# Altium schematic sheet AT89S52继电器工控板.SCHDOC
size A3
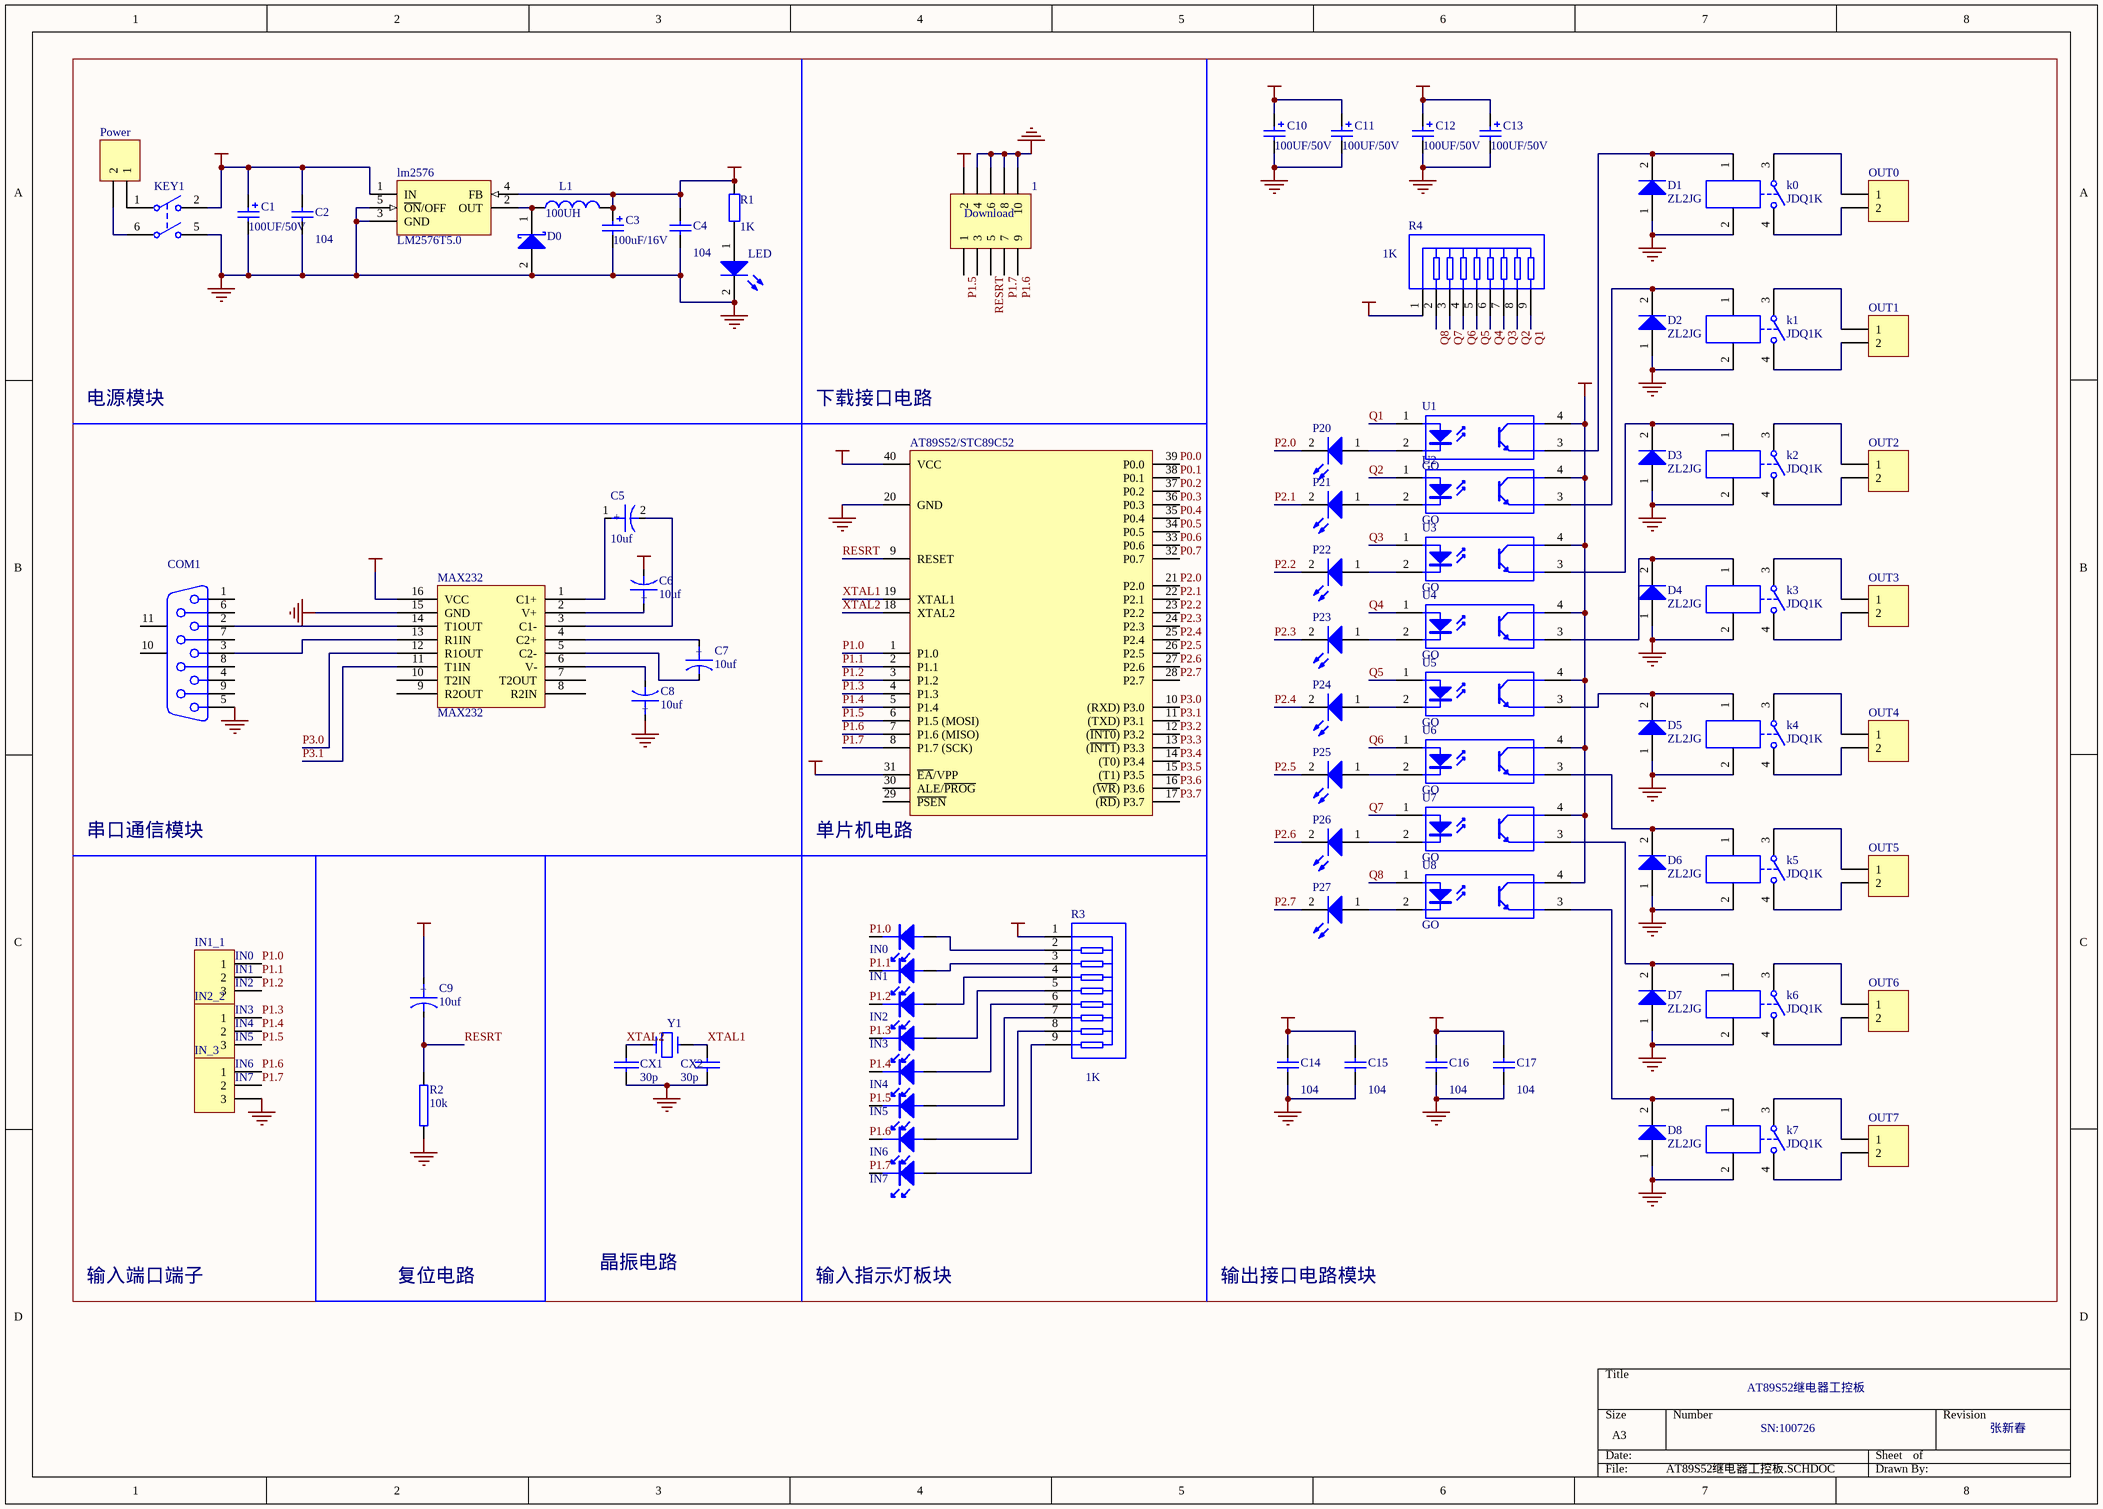
[diagram p0: AT89S52继电器工控板.SCHDOC]

## Parts
1  Download  [HDR-2x5]
AT89S52/STC89C52  (no value)  [DIP-40]
C1  value 100UF/50V  [C-DJ-6]  (hidden comment: DJDR)
C2  value 104  [CPDR]  (hidden comment: CPDR)
C3  value 100uF/16V  [C-DJ-6]  (hidden comment: DJDR)
C4  value 104  [CPDR]  (hidden comment: CPDR)
C5  10uf  [C-DJ-4]
C6  10uf  [C-DJ-4]
C7  10uf  [C-DJ-4]
C8  10uf  [C-DJ-4]
C9  10uf  [C-DJ-4]
C10  value 100UF/50V  [C-DJ-6]  (hidden comment: DJDR)
C11  value 100UF/50V  [C-DJ-6]  (hidden comment: DJDR)
C12  value 100UF/50V  [C-DJ-6]  (hidden comment: DJDR)
C13  value 100UF/50V  [C-DJ-6]  (hidden comment: DJDR)
C14  value 104  [CPDR]  (hidden comment: CPDR)
C15  value 104  [CPDR]  (hidden comment: CPDR)
C16  value 104  [CPDR]  (hidden comment: CPDR)
C17  value 104  [CPDR]  (hidden comment: CPDR)
COM1  D Connector 9  [DSUB1.385-2H9]  (value not drawn)
CX1  30p  [HDR1X2]
CX2  30p  [HDR1X2]
D0  WY2JG  [ZCDZL]  (value not drawn)
D1  ZL2JG  [D-ZL-10]
D2  ZL2JG  [D-ZL-10]
D3  ZL2JG  [D-ZL-10]
D4  ZL2JG  [D-ZL-10]
D5  ZL2JG  [D-ZL-10]
D6  ZL2JG  [D-ZL-10]
D7  ZL2JG  [D-ZL-10]
D8  ZL2JG  [D-ZL-10]
IN0  LED  [HDR1X2]  (value not drawn)
IN1  LED  [HDR1X2]  (value not drawn)
IN1_1  PZ_3  [JK128_3]  (value not drawn)
IN2  LED  [HDR1X2]  (value not drawn)
IN2_2  PZ_3  [JK128_3]
IN3  LED  [HDR1X2]  (value not drawn)
IN4  LED  [HDR1X2]  (value not drawn)
IN5  LED  [HDR1X2]  (value not drawn)
IN6  LED  [HDR1X2]  (value not drawn)
IN7  LED  [HDR1X2]  (value not drawn)
IN_3  (no value)  [JK128_3]
k0  JDQ1K  [JDQ1KI]
k1  JDQ1K  [JDQ1KI]
k2  JDQ1K  [JDQ1KI]
k3  JDQ1K  [JDQ1KI]
k4  JDQ1K  [JDQ1KI]
k5  JDQ1K  [JDQ1KI]
k6  JDQ1K  [JDQ1KI]
k7  JDQ1K  [JDQ1KI]
KEY1  SW-DPST  [DPDT-6]  (value not drawn)
L1  value 100UH  [L_DG]  (hidden comment: DG)
LED  LED  [LED_D]  (value not drawn)
lm2576  LM2576T5.0  [LM2576]
MAX232  MAX232  [DIP16]
OUT0  PZ_2  [DYDZ]  (value not drawn)
OUT1  PZ_2  [DYDZ]  (value not drawn)
OUT2  PZ_2  [DYDZ]  (value not drawn)
OUT3  PZ_2  [DYDZ]  (value not drawn)
OUT4  PZ_2  [DYDZ]  (value not drawn)
OUT5  PZ_2  [DYDZ]  (value not drawn)
OUT6  PZ_2  [DYDZ]  (value not drawn)
OUT7  PZ_2  [DYDZ]  (value not drawn)
P20  (no value)  [CPDR]
P21  (no value)  [CPDR]
P22  (no value)  [CPDR]
P23  (no value)  [CPDR]
P24  (no value)  [CPDR]
P25  (no value)  [CPDR]
P26  (no value)  [CPDR]
P27  (no value)  [CPDR]
Power  PZ_2  [JK128_2]  (value not drawn)
R1  value 1K  [CPDR]  (hidden comment: Res)
R2  10k  [CPDR]
R3  value 1K  [HDR-9]
R4  value 1K  [HDR-9]
U1  GO  [DIP-4]
U2  GO  [DIP-4]
U3  GO  [DIP-4]
U4  GO  [DIP-4]
U5  GO  [DIP-4]
U6  GO  [DIP-4]
U7  GO  [DIP-4]
U8  GO  [DIP-4]
Y1  Y1  [JZ_ZC]

## Nets
+5V: 1.2 AT89S52/STC89C52.31(~{EA}/VPP) AT89S52/STC89C52.40(VCC) C3.1 C4.2 C6.2 C9.1 C12.1 C13.1 C16.2 C17.2 L1.2 lm2576.4(FB) MAX232.16(VCC) R1.2 R3.1 R4.1
+12V: C1.1 C2.2 C10.1 C11.1 C14.2 C15.2 KEY1.2(NO1) lm2576.1(IN) U1.4(C) U2.4(C) U3.4(C) U4.4(C) U5.4(C) U6.4(C) U7.4(C) U8.4(C)
GND: 1.4 1.6 1.8 1.10 AT89S52/STC89C52.20(GND) C1.2 C2.1 C3.2 C4.1 C8.1 C10.2 C11.2 C12.2 C13.2 C14.1 C15.1 C16.1 C17.1 COM1.5 CX1.2 CX2.2 D0.2(K) D1.1(A) D2.1(A) D3.1(A) D4.1(A) D5.1(A) D6.1(A) D7.1(A) D8.1(A) IN_3.3 k0.2 k1.2 k2.2 k3.2 k4.2 k5.2 k6.2 k7.2 KEY1.5(NO2) LED.2(K) lm2576.3(GND) lm2576.5(~{ON}/OFF) MAX232.15(GND) R2.1
P0.0: AT89S52/STC89C52.39(P0.0)
P0.1: AT89S52/STC89C52.38(P0.1)
P0.2: AT89S52/STC89C52.37(P0.2)
P0.3: AT89S52/STC89C52.36(P0.3)
P0.4: AT89S52/STC89C52.35(P0.4)
P0.5: AT89S52/STC89C52.34(P0.5)
P0.6: AT89S52/STC89C52.33(P0.6)
P0.7: AT89S52/STC89C52.32(P0.7)
P1.0: AT89S52/STC89C52.1(P1.0) IN0.2(K) IN1_1.1
P1.1: AT89S52/STC89C52.2(P1.1) IN1.2(K) IN1_1.2
P1.2: AT89S52/STC89C52.3(P1.2) IN1_1.3 IN2.2(K)
P1.3: AT89S52/STC89C52.4(P1.3) IN2_2.1 IN3.2(K)
P1.4: AT89S52/STC89C52.5(P1.4) IN2_2.2 IN4.2(K)
P1.5: 1.1 AT89S52/STC89C52.6(P1.5_(MOSI)) IN2_2.3 IN5.2(K)
P1.6: 1.9 AT89S52/STC89C52.7(P1.6_(MISO)) IN6.2(K) IN_3.1
P1.7: 1.7 AT89S52/STC89C52.8(P1.7_(SCK)) IN7.2(K) IN_3.2
P2.0: AT89S52/STC89C52.21(P2.0) P20.2(K)
P2.1: AT89S52/STC89C52.22(P2.1) P21.2(K)
P2.2: AT89S52/STC89C52.23(P2.2) P22.2(K)
P2.3: AT89S52/STC89C52.24(P2.3) P23.2(K)
P2.4: AT89S52/STC89C52.25(P2.4) P24.2(K)
P2.5: AT89S52/STC89C52.26(P2.5) P25.2(K)
P2.6: AT89S52/STC89C52.27(P2.6) P26.2(K)
P2.7: AT89S52/STC89C52.28(P2.7) P27.2(K)
P3.0: AT89S52/STC89C52.10((RXD)_P3.0) MAX232.12(R1OUT)
P3.1: AT89S52/STC89C52.11((TXD)_P3.1) MAX232.11(T1IN)
P3.2: AT89S52/STC89C52.12((~{INT0})_P3.2)
P3.3: AT89S52/STC89C52.13((~{INT1})_P3.3)
P3.4: AT89S52/STC89C52.14((T0)_P3.4)
P3.5: AT89S52/STC89C52.15((T1)_P3.5)
P3.6: AT89S52/STC89C52.16((~{WR})_P3.6)
P3.7: AT89S52/STC89C52.17((~{RD})_P3.7)
Q1: R4.9 U1.1(A)
Q2: R4.8 U2.1(A)
Q3: R4.7 U3.1(A)
Q4: R4.6 U4.1(A)
Q5: R4.5 U5.1(A)
Q6: R4.4 U6.1(A)
Q7: R4.3 U7.1(A)
Q8: R4.2 U8.1(A)
RESRT: 1.5 AT89S52/STC89C52.9(RESET) C9.2 R2.2
XTAL1: AT89S52/STC89C52.19(XTAL1) CX2.1 Y1.1
XTAL2: AT89S52/STC89C52.18(XTAL2) CX1.1 Y1.2
NetC5_1: C5.1 MAX232.1(C1+)
NetC5_2: C5.2 MAX232.3(C1-)
NetC6_1: C6.1 MAX232.2(V+)
NetC7_1: C7.1 MAX232.4(C2+)
NetC7_2: C7.2 MAX232.5(C2-)
NetC8_2: C8.2 MAX232.6(V-)
NetCOM1_2: COM1.2 MAX232.14(T1OUT)
NetCOM1_3: COM1.3 MAX232.13(R1IN)
NetD0_1: D0.1(A) L1.1 lm2576.2(OUT)
NetD1_2: D1.2(K) k0.1 U1.3(E)
NetD2_2: D2.2(K) k1.1 U2.3(E)
NetD3_2: D3.2(K) k2.1 U3.3(E)
NetD4_2: D4.2(K) k3.1 U4.3(E)
NetD5_2: D5.2(K) k4.1 U5.3(E)
NetD6_2: D6.2(K) k5.1 U6.3(E)
NetD7_2: D7.2(K) k6.1 U7.3(E)
NetD8_2: D8.2(K) k7.1 U8.3(E)
NetIN0_1: IN0.1(A) R3.2
NetIN1_1: IN1.1(A) R3.3
NetIN2_1: IN2.1(A) R3.4
NetIN3_1: IN3.1(A) R3.5
NetIN4_1: IN4.1(A) R3.6
NetIN5_1: IN5.1(A) R3.7
NetIN6_1: IN6.1(A) R3.8
NetIN7_1: IN7.1(A) R3.9
Netk0_3: k0.3 OUT0.1
Netk0_4: k0.4 OUT0.2
Netk1_3: k1.3 OUT1.1
Netk1_4: k1.4 OUT1.2
Netk2_3: k2.3 OUT2.1
Netk2_4: k2.4 OUT2.2
Netk3_3: k3.3 OUT3.1
Netk3_4: k3.4 OUT3.2
Netk4_3: k4.3 OUT4.1
Netk4_4: k4.4 OUT4.2
Netk5_3: k5.3 OUT5.1
Netk5_4: k5.4 OUT5.2
Netk6_3: k6.3 OUT6.1
Netk6_4: k6.4 OUT6.2
Netk7_3: k7.3 OUT7.1
Netk7_4: k7.4 OUT7.2
NetKEY1_1: KEY1.1(COMMON1) Power.1
NetKEY1_6: KEY1.6(COMMON2) Power.2
NetLED_1: LED.1(A) R1.1
NetP20_1: P20.1(A) U1.2(K)
NetP21_1: P21.1(A) U2.2(K)
NetP22_1: P22.1(A) U3.2(K)
NetP23_1: P23.1(A) U4.2(K)
NetP24_1: P24.1(A) U5.2(K)
NetP25_1: P25.1(A) U6.2(K)
NetP26_1: P26.1(A) U7.2(K)
NetP27_1: P27.1(A) U8.2(K)

Not connected (* = marked no-connect by the designer): 1 3; AT89S52/STC89C52 29(~{PSEN}) 30(ALE/~{PROG}); COM1 1 4 6 7 8 9 10(MH1) 11(MH2); MAX232 7(T2OUT) 8(R2IN) 9(R2OUT) 10(T2IN)

## Notes on the sheet
- 电源模块
- 下载接口电路
- 串口通信模块
- (near AT89S52/STC89C52) 单片机电路
- (near IN1_1) IN1
- (near IN1_1) IN2
- (near IN1_1) IN0
- (near IN2_2) IN3
- (near IN2_2) IN4
- (near IN2_2) IN5
- (near IN_3) IN6
- (near IN_3) IN7
- 输入端口端子
- 复位电路
- 晶振电路
- 输入指示灯板块
- 输出接口电路模块
- AT89S52继电器工控板
- SN:100726
- 张新春
- (in symbol CAPACITOR POL) +

## Library data of the parts
1 = Header 5X2: Header, 5-Pin, Dual row; Revision: 17-Jul-2002: Re-released for DXP Platform.; Publisher: Altium Limited
AT89S52/STC89C52 = AT89S52-P: 8 位微处理器/40引脚; 子类别: 微处理器; 发布者: 磊元工作室; 发布日期: 2003年8月18日; 制造商: Atmel Corporation; 类别: 集成电路; 元件名称（国标）: 8 位微处理器; 元件名称（英文）: 8-bit Microcontroller; 特性:存储器容量: Flash：8KB  ，RAM：256B; 特性:定时器/计数器: 3 个 16-bit
C1 C3 C10-C13 = DJDR: 电解电容; Published: 8-Jun-2000; LatestRevisionDate: 17-Jul-2002; LatestRevisionNote: Re-released for DXP Platform.; Publisher: Altium Limited
C2 C4 C14-C17 = CPDR: 瓷片电容; Published: 8-Jun-2000; LatestRevisionDate: 17-Jul-2002; LatestRevisionNote: Re-released for DXP Platform.; Publisher: Altium Limited
C5-C9 = CAPACITOR POL: Capacitor
COM1 = D Connector 9: Receptacle Assembly, 9 Position, Right Angle; Package Information: Latest Revision: O; Positions: 9; Published: 15-Jun-2001; Revision: 17-Jul-2002: Re-released for DXP Platform.; Datasheet: (1-Sep-1999); Package Reference: 788750; Publisher: Altium Limited; Orientation: Right Angle; Gender: Receptacle
CX1 CX2 = CAP: Capacitor
D0 = WY2JG: 稳压二级管; Published: 8-Jun-2000; LatestRevisionDate: 17-Jul-2002; LatestRevisionNote: Re-released for DXP Platform.; Publisher: Altium Limited; Code_JEDEC: DO-214-AA
D1-D8 = ZL2JG: 整流二极管; Published: 8-Jun-2000; LatestRevisionDate: 17-Jul-2002; LatestRevisionNote: Re-released for DXP Platform.; DatasheetDocument: 1998; PackageDocument: Aug-1999; PackageReference: DO-201AD; Publisher: Altium Limited
IN1_1 IN2_2 IN_3 = PZ_3: 排针——3; LatestRevisionDate: 17-Jul-2002; LatestRevisionNote: Re-released for DXP Platform.; Publisher: Altium Limited
k0-k7 = JDQ1K: 继电器一常开
KEY1 = SW-DPST: Double-Pole, Single-Throw Switch; Published: 24-Mar-1999; Revision: July-2002: Re-released for DXP Platform.; Publisher: Altium Limited
L1 = DG: 电感; Code_IEC: 1005; Published: 8-Jun-2000; LatestRevisionDate: 17-Jul-2002; LatestRevisionNote: Re-released for DXP Platform.; PackageReference: 0402-A; Publisher: Altium Limited; Code_JEITA: 0402
LED P20-P27 = LED: 发光二极管; Published: 8-Jun-2000; LatestRevisionDate: 17-Jul-2002; LatestRevisionNote: Re-released for DXP Platform.; Publisher: Altium Limited
lm2576 = LM2576HVT-3.3: Simple Switcher 3A Step Down Voltage Regulator; PackageDocument: 2000; Note: Tab is connected to GND; Published: 15-Apr-2002; DatasheetDocument: Jun-1999; PackageReference: T05A; Publisher: Altium Limited; Code_JEDEC: TS-001-AA; ComponentLink1Description: Manufacturer Link; ComponentLink1URL: http://www.national.com/
OUT0-OUT7 Power = PZ_2: 排针——2; LatestRevisionDate: 17-Jul-2002; LatestRevisionNote: Re-released for DXP Platform.; Publisher: Altium Limited
R1 = Res: 电阻; Published: 8-Jun-2000; LatestRevisionDate: 17-Jul-2002; LatestRevisionNote: Re-released for DXP Platform.; Publisher: Altium Limited
R2 = RES2
R3 R4 = Res PZ_8: 8位排阻; Published: 24-Mar-1999; LatestRevisionDate: 17-Jul-2002; LatestRevisionNote: Re-released for DXP Platform.; Publisher: Altium Limited; Code_JEDEC: MO-150-AC
U1-U8 = GO: 光耦; Published: 24-Mar-1999; LatestRevisionDate: 17-Jul-2002; LatestRevisionNote: Re-released for DXP Platform.; Publisher: Altium Limited
Y1 = CRYSTAL